# Altium schematic sheet 红外热像仪-V1.SchDoc
size A2
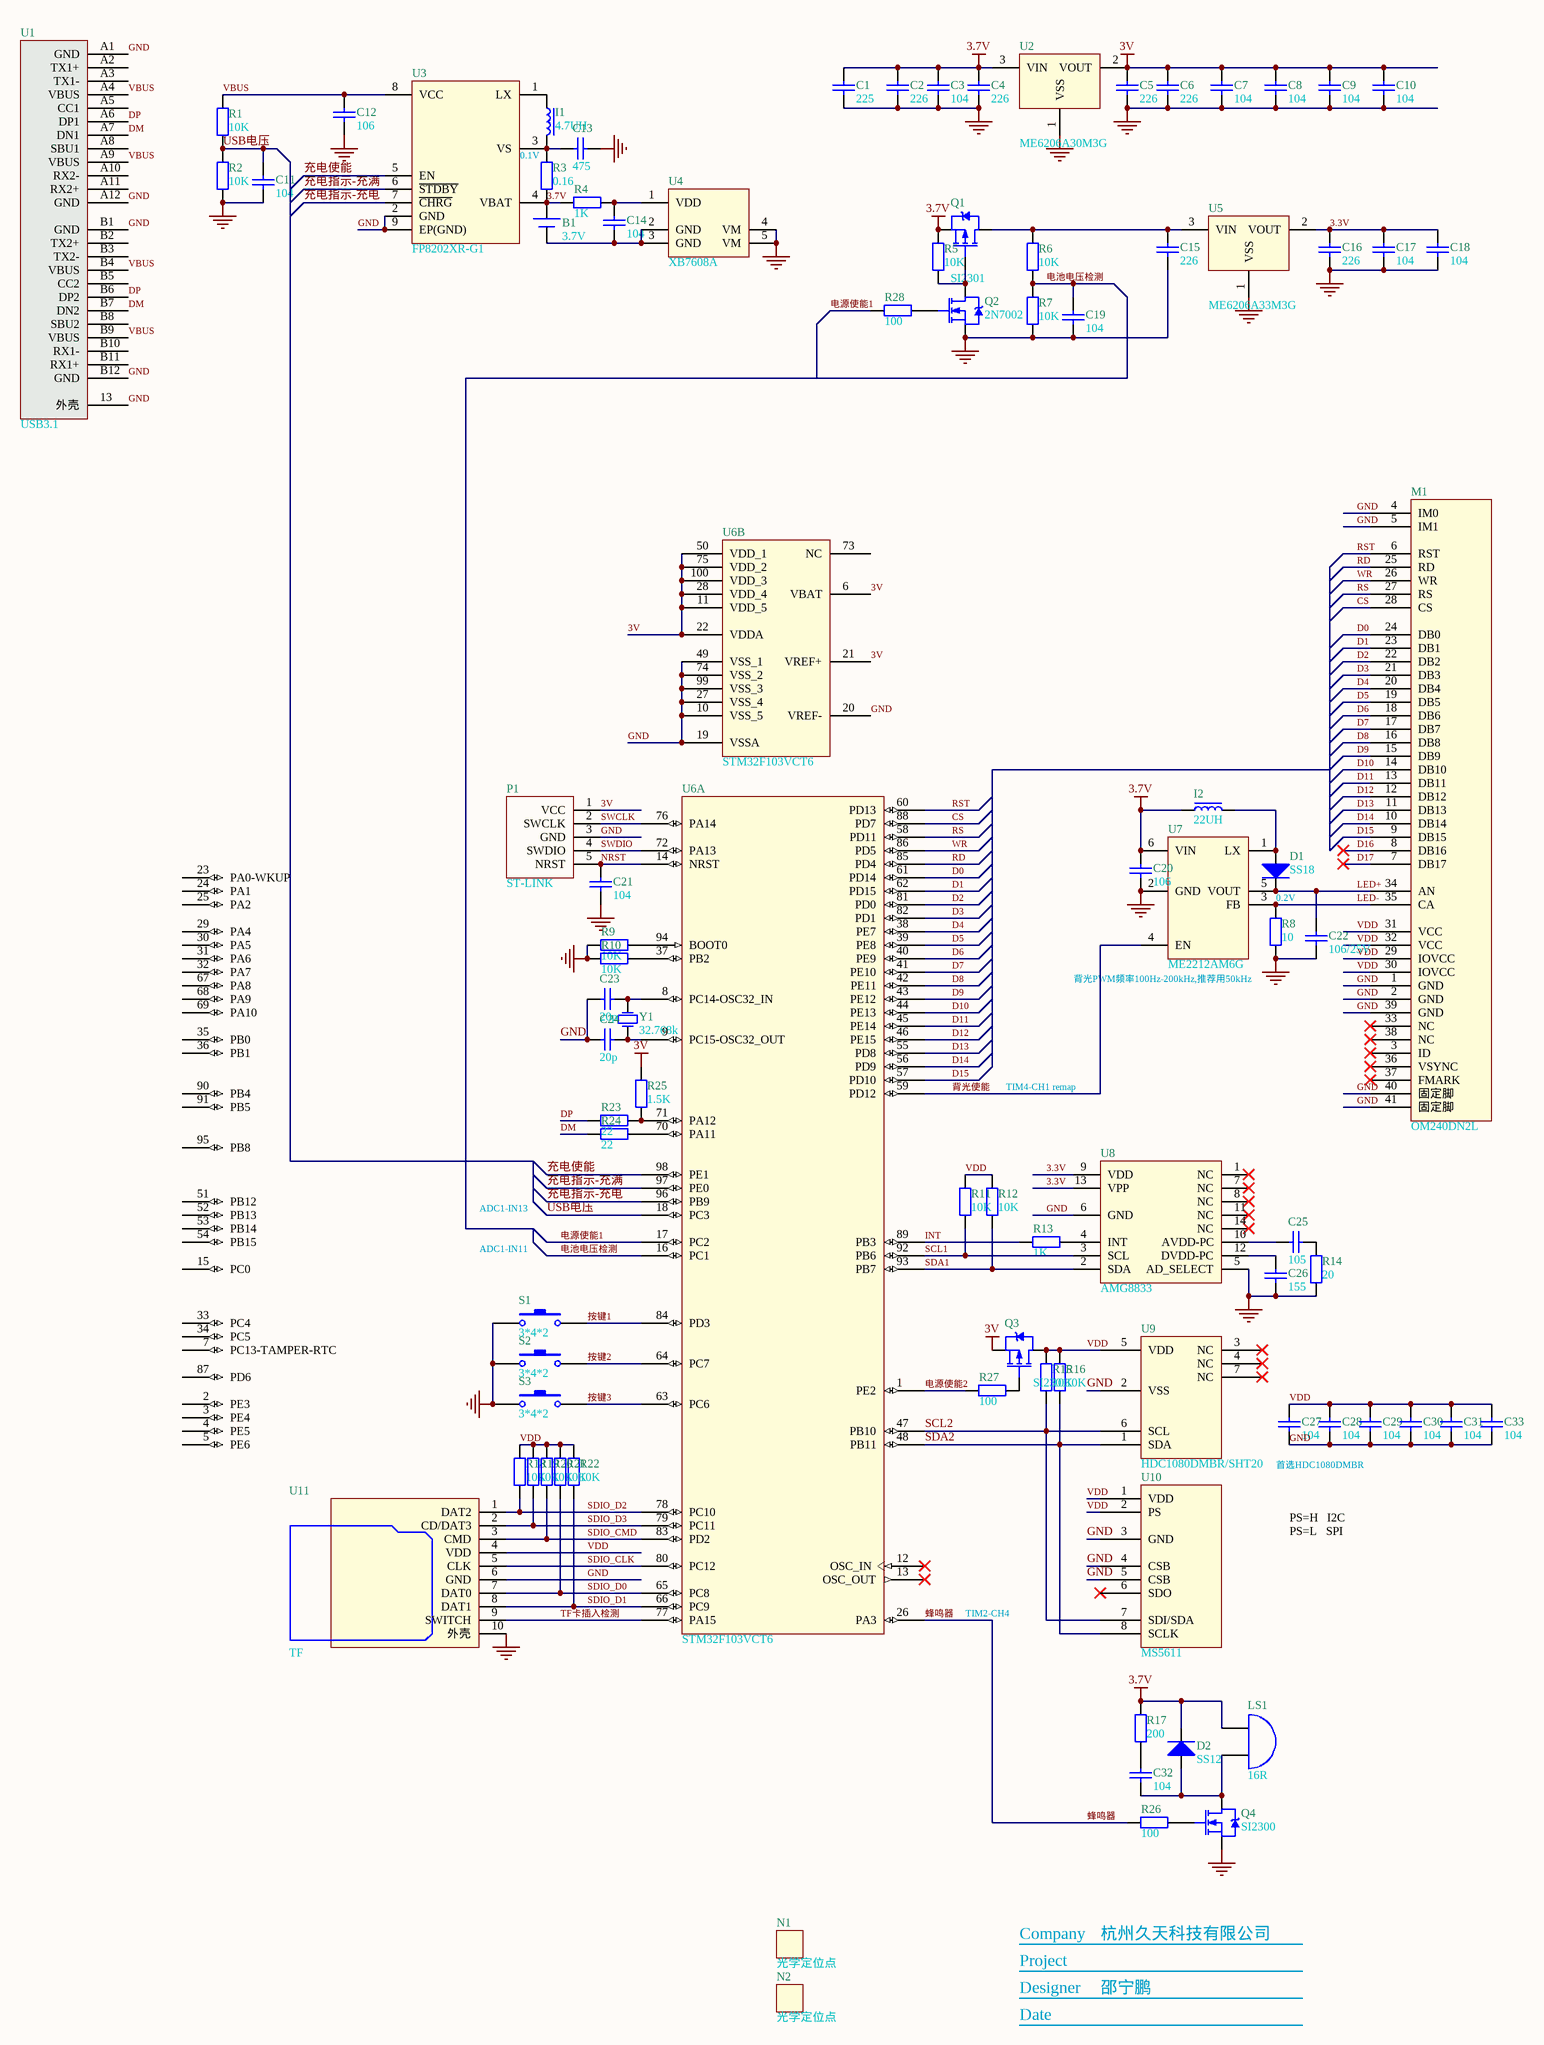
[diagram p0: 红外热像仪-V1.SchDoc]

## Parts
B1  3.7V  [PH2.0-卧式贴片-2P]
C1  225  [C-0603]
C2  226  [C-0603]
C3  104  [C-0603]
C4  226  [C-0603]
C5  226  [C-0603]
C6  226  [C-0603]
C7  104  [C-0603]
C8  104  [C-0603]
C9  104  [C-0603]
C10  104  [C-0603]
C11  104  [C-0603]
C12  106  [C-0603]
C13  475  [C-0603]
C14  104  [C-0603]
C15  226  [C-0603]
C16  226  [C-0603]
C17  104  [C-0603]
C18  104  [C-0603]
C19  104  [C-0603]
C20  106  [C-0603]
C21  104  [C-0603]
C22  106/25V  [C-0603]
C23  20p  [C-0603]
C24  20p  [C-0603]
C25  105  [C-0603]
C26  155  [C-0603]
C27  104  [C-0603]
C28  104  [C-0603]
C29  104  [C-0603]
C30  104  [C-0603]
C31  104  [C-0603]
C32  104  [C-0603]
C33  104  [C-0603]
D1  SS18  [SOD-523/0603]
D2  SS12  [SOD-523/0603]
I1  4.7UH  [一体成型电感0420]
I2  22UH  [PRS3015]
LS1  16R  [蜂鸣器DET402-G-1]
M1  OM240DN2L  [OM240DN2L]
N1  光学定位点  [MARK-1mm-3mm]
N2  光学定位点  [MARK-1mm-3mm]
P1  ST-LINK  [5P下载口]
Q1  SI2301  [SOT-23]
Q2  2N7002  [SOT-23]
Q3  SI2301  [SOT-23]
Q4  SI2300  [SOT-23]
R1  10K  [R-0603]
R2  10K  [R-0603]
R3  0.16  [R-1206-M]
R4  1K  [R-0603]
R5  10K  [R-0603]
R6  10K  [R-0603]
R7  10K  [R-0603]
R8  10  [R-0603]
R9  10K  [R-0603]
R10  10K  [R-0603]
R11  10K  [R-0603]
R12  10K  [R-0603]
R13  1K  [R-0603]
R14  20  [R-0603]
R15  10K  [R-0603]
R16  10K  [R-0603]
R17  200  [R-0603]
R18  10K  [R-0603]
R19  10K  [R-0603]
R20  10K  [R-0603]
R21  10K  [R-0603]
R22  10K  [R-0603]
R23  22  [R-0603]
R24  22  [R-0603]
R25  1.5K  [R-0603]
R26  100  [R-0603]
R27  100  [R-0603]
R28  100  [R-0603]
S1  3*4*2  [SB-3*4*2]
S2  3*4*2  [SB-3*4*2]
S3  3*4*2  [SB-3*4*2]
U1  USB3.1  [USB-TYPE-C-16P-N]
U2  ME6206A30M3G  [SOT-23]
U3  FP8202XR-G1  [SOP-8-N+1]
U4  XB7608A  [CPC5-M]
U5  ME6206A33M3G  [SOT-23]
U6  STM32F103VCT6  [LQFP100]  (parts A,B of 2)
U7  ME2212AM6G  [SOT-23-6-M]
U8  AMG8833  [AMG8833]
U9  HDC1080DMBR/SHT20  [DFN-6-N]
U10  MS5611  [MS5611]
U11  TF  [TF卡座 自弹]
Y1  32.768k  [FC135]

## Nets
3.7V: B1.2(-) C1.2 C2.2 C3.2 C4.2 C20.1 D2.2(K) I2.1 LS1.1(A) Q1.2(S) R3.1 R4.1 R5.2 R17.2 U2.3(VIN) U3.4(VBAT) U7.6(VIN)
3V: C5.2 C6.2 C7.2 C8.2 C9.2 C10.2 P1.1(VCC) Q3.2(S) R25.1 U2.2(VOUT) U6.6(VBAT) U6.11(VDD_5) U6.21(VREF+) U6.22(VDDA) U6.28(VDD_4) U6.50(VDD_1) U6.75(VDD_2) U6.100(VDD_3)
GND: C1.1 C2.1 C3.1 C4.1 C5.1 C6.1 C7.1 C8.1 C9.1 C10.1 C11.1 C12.1 C13.1 C15.1 C16.1 C17.1 C18.1 C19.1 C20.2 C21.1 C22.1 C23.2 C24.2 C26.1 C27.1 C28.1 C29.1 C30.1 C31.1 C33.1 M1.1(GND) M1.2(GND) M1.4(IM0) M1.5(IM1) M1.39(GND) M1.40(固定脚) M1.41(固定脚) P1.3(GND) Q2.2(S) Q4.2(S) R2.1 R7.1 R8.1 R9.2 R10.2 R14.2 S1.2 S2.1 S3.2 U1.13(外壳) U1.A1(GND) U1.A12(GND) U1.B1(GND) U1.B12(GND) U2.1(VSS) U3.2(GND) U3.9(EP(GND)) U4.4(VM) U4.5(VM) U5.1(VSS) U6.10(VSS_5) U6.19(VSSA) U6.20(VREF-) U6.27(VSS_4) U6.49(VSS_1) U6.74(VSS_2) U6.99(VSS_3) U7.2(GND) U8.5(AD_SELECT) U8.6(GND) U9.2(VSS) U10.3(GND) U10.4(CSB) U10.5(CSB) U11.6(GND) U11.10(外壳)
3.3V: C16.2 C17.2 C18.2 U5.2(VOUT) U8.9(VDD) U8.13(VPP)
CS: M1.28(CS) U6.88(PD7)
D0: M1.24(DB0) U6.61(PD14)
D1: M1.23(DB1) U6.62(PD15)
D2: M1.22(DB2) U6.81(PD0)
D3: M1.21(DB3) U6.82(PD1)
D4: M1.20(DB4) U6.38(PE7)
D5: M1.19(DB5) U6.39(PE8)
D6: M1.18(DB6) U6.40(PE9)
D7: M1.17(DB7) U6.41(PE10)
D8: M1.16(DB8) U6.42(PE11)
D9: M1.15(DB9) U6.43(PE12)
D10: M1.14(DB10) U6.44(PE13)
D11: M1.13(DB11) U6.45(PE14)
D12: M1.12(DB12) U6.46(PE15)
D13: M1.11(DB13) U6.55(PD8)
D14: M1.10(DB14) U6.56(PD9)
D15: M1.9(DB15) U6.57(PD10)
D16: M1.8(DB16)
D17: M1.7(DB17)
DM: R24.1 U1.A7(DN1) U1.B7(DN2)
DP: R23.1 U1.A6(DP1) U1.B6(DP2)
INT: R13.2 U6.89(PB3)
LED+: C22.2 D1.2(K) M1.34(AN) U7.5(VOUT)
LED-: M1.35(CA) R8.2 U7.3(FB)
NRST: C21.2 P1.5(NRST) U6.14(NRST)
RD: M1.25(RD) U6.85(PD4)
RS: M1.27(RS) U6.58(PD11)
RST: M1.6(RST) U6.60(PD13)
SCL1: R11.2 U6.92(PB6) U8.3(SCL)
SCL2: R15.1 U6.47(PB10) U9.6(SCL) U10.7(SDI/SDA)
SDA1: R12.2 U6.93(PB7) U8.2(SDA)
SDA2: R16.1 U6.48(PB11) U9.1(SDA) U10.8(SCLK)
SDIO_CLK: U6.80(PC12) U11.5(CLK)
SDIO_CMD: R20.2 U6.83(PD2) U11.3(CMD)
SDIO_D0: R21.2 U6.65(PC8) U11.7(DAT0)
SDIO_D1: R22.2 U6.66(PC9) U11.8(DAT1)
SDIO_D2: R18.2 U6.78(PC10) U11.1(DAT2)
SDIO_D3: R19.2 U6.79(PC11) U11.2(CD/DAT3)
SWCLK: P1.2(SWCLK) U6.76(PA14)
SWDIO: P1.4(SWDIO) U6.72(PA13)
TF卡插入检测: U6.77(PA15) U11.9(SWITCH)
USB电压: C11.2 R1.1 R2.2 U6.18(PC3)
VBUS: C12.2 R1.2 U1.A4(VBUS) U1.A9(VBUS) U1.B4(VBUS) U1.B9(VBUS) U3.8(VCC)
VDD: C27.2 C28.2 C29.2 C30.2 C31.2 C33.2 M1.29(IOVCC) M1.30(IOVCC) M1.31(VCC) M1.32(VCC) Q3.3(D) R11.1 R12.1 R15.2 R16.2 R18.1 R19.1 R20.1 R21.1 R22.1 U9.5(VDD) U10.1(VDD) U10.2(PS) U11.4(VDD)
WR: M1.26(WR) U6.86(PD5)
充电使能: U3.5(EN) U6.98(PE1)
充电指示-充满: U3.6(~{STDBY}) U6.97(PE0)
充电指示-充电: U3.7(~{CHRG}) U6.96(PB9)
按键1: S1.1 U6.84(PD3)
按键2: S2.2 U6.64(PC7)
按键3: S3.1 U6.63(PC6)
电池电压检测: C19.2 R6.1 R7.2 U6.16(PC1)
电源使能1: R28.1 U6.17(PC2)
电源使能2: R27.1 U6.1(PE2)
背光使能: U6.59(PD12) U7.4(EN)
蜂鸣器: R26.2 U6.26(PA3)
NetB1_1: B1.1(+) C14.1 U4.2(GND) U4.3(GND)
NetC13_2: C13.2 I1.2 R3.2 U3.3(VS)
NetC14_2: C14.2 R4.2 U4.1(VDD)
NetC15_2: C15.2 Q1.3(D) R6.2 U5.3(VIN)
NetC23_1: C23.1 U6.8(PC14-OSC32_IN) Y1.2(OSC2)
NetC24_1: C24.1 U6.9(PC15-OSC32_OUT) Y1.1(OSC1)
NetC25_1: C25.1 R14.1
NetC25_2: C25.2 U8.10(AVDD-PC)
NetC26_2: C26.2 U8.12(DVDD-PC)
NetC32_1: C32.1 D2.1(A) LS1.2(B) Q4.3(D)
NetC32_2: C32.2 R17.1
NetD1_1: D1.1(A) I2.2 U7.1(LX)
NetI1_1: I1.1 U3.1(LX)
NetQ1_1: Q1.1(G) Q2.3(D) R5.1
NetQ2_1: Q2.1(G) R28.2
NetQ3_1: Q3.1(G) R27.2
NetQ4_1: Q4.1(G) R26.1
NetR9_1: R9.1 U6.94(BOOT0)
NetR10_1: R10.1 U6.37(PB2)
NetR13_1: R13.1 U8.4(INT)
NetR23_2: R23.2 R25.2 U6.71(PA12)
NetR24_2: R24.2 U6.70(PA11)

Not connected (* = marked no-connect by the designer): M1 3(ID)* 33(NC)* 36(VSYNC)* 37(FMARK)* 38(NC)*; U1 A2(TX1+) A3(TX1-) A5(CC1) A8(SBU1) A10(RX2-) A11(RX2+) B2(TX2+) B3(TX2-) B5(CC2) B8(SBU2) B10(RX1-) B11(RX1+); U6 2(PE3) 3(PE4) 4(PE5) 5(PE6) 7(PC13-TAMPER-RTC) 12(OSC_IN)* 13(OSC_OUT)* 15(PC0) 23(PA0-WKUP) 24(PA1) 25(PA2) 29(PA4) 30(PA5) 31(PA6) 32(PA7) 33(PC4) 34(PC5) 35(PB0) 36(PB1) 51(PB12) 52(PB13) 53(PB14) 54(PB15) 67(PA8) 68(PA9) 69(PA10) 73(NC) 87(PD6) 90(PB4) 91(PB5) 95(PB8); U8 1(NC)* 7(NC)* 8(NC)* 11(NC)* 14(NC)*; U9 3(NC)* 4(NC)* 7(NC)*; U10 6(SDO)*

## Notes on the sheet
- (near U3) 0.1V
- 0.2V
- (near U7) 背光PWM频率100Hz-200kHz,推荐用50kHz
- TIM4-CH1 remap
- (near U6) ADC1-IN13
- (near U6) ADC1-IN11
- 首选HDC1080DMBR
- PS=H   I2C
- PS=L   SPI
- TIM2-CH4
- Project
- Company
- 杭州久天科技有限公司
- Designer
- Date
- 邵宁鹏

## Library data of the parts
B1 = Battery1: 锂电池
C1-C33 = Cap-0603: 0805; Published: 8-Jun-2000; LatestRevisionDate: 17-Jul-2002; LatestRevisionNote: Re-released for DXP Platform.; PackageReference: RAD-0.3; Publisher: Altium Limited
D1 D2 = SS14: SMA
I1 I2 = Inductance3
LS1 = Bell: Electrical Bell; Published: 24-Mar-1999; LatestRevisionDate: 17-Jul-2002; LatestRevisionNote: Re-released for DXP Platform.; PackageReference: PIN2; Publisher: Altium Limited
N1 N2 = 无引脚
P1 = ST-LINK-STM32
Q1 Q3 = SI2301: SOT-23
Q4 = 2N7002
R1 R2 R5-R8 R13 = Res2: 0805; Published: 8-Jun-2000; LatestRevisionDate: 17-Jul-2002; LatestRevisionNote: Re-released for DXP Platform.; PackageReference: AXIAL-0.4; Publisher: Altium Limited
R3 R4 R9-R12 R14-R28 = Res2-0603: 0603; Published: 8-Jun-2000; LatestRevisionDate: 17-Jul-2002; LatestRevisionNote: Re-released for DXP Platform.; PackageReference: AXIAL-0.4; Publisher: Altium Limited
S1-S3 = SB-6*6*9: SB-6*6*10; Published: 24-Mar-1999; LatestRevisionDate: 17-Jul-2002; LatestRevisionNote: Re-released for DXP Platform.; PackageReference: SPST-2; Publisher: Altium Limited
U1 = USB3.1-2
U2 U5 = ME6206A33M3G: LDO稳压 SOT-23
U3 = FP8202XR-G1: 单节锂电池充电2A
U7 = ME2212AM6G: LED升压恒流
U9 = SHT20: 温湿度传感器
U10 = MS5611: 气压传感器
U11 = TF卡座-自弹
Y1 = 晶振